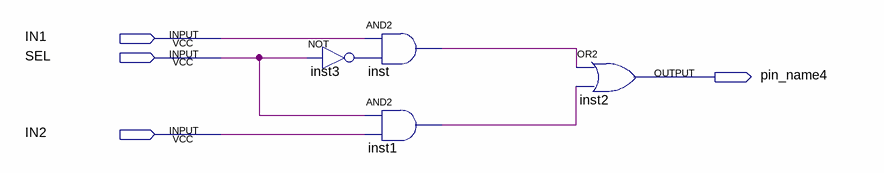
[diagram p0: schematic sheet]
// Quartus schematic Block1.bdf as structural Verilog: 4 symbols, 4 pins
module Block1 (
  input  IN1,
  input  SEL,
  input  IN2,
  output pin_name4
);

  wire inst1_out, inst3_out, inst_out;

  and inst (inst_out, IN1, inst3_out);
  not inst3 (inst3_out, SEL);
  and inst1 (inst1_out, SEL, IN2);
  or inst2 (pin_name4, inst_out, inst1_out);
endmodule
